# Altium schematic sheet PCA9306DP1.SchDoc
size A4
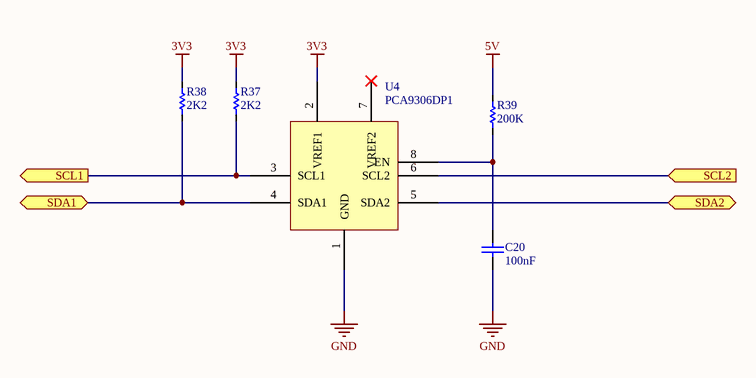
[diagram p0: PCA9306DP1.SchDoc]

## Parts
C20  100nF  [C0603(1608)]
R37  2K2  [R0603(1608)]
R38  2K2  [R0603(1608)]
R39  200K  [R0603(1608)]
U4  PCA9306DP1  [8-TSSOP]

## Ports
SCL1 (out), SCL2 (in), SDA1 (bidir), SDA2 (bidir)

## Nets
3V3: R37.2 R38.2 U4.2(VREF1)
5V: R39.2
GND: C20.1 U4.1(GND)
SCL1: R37.1 U4.3(SCL1) ; port SCL1
SCL2: U4.6(SCL2) ; port SCL2
SDA1: R38.1 U4.4(SDA1) ; port SDA1
SDA2: U4.5(SDA2) ; port SDA2
NetC20_2: C20.2 R39.1 U4.8(EN)

Not connected (* = marked no-connect by the designer): U4 7(VREF2)*

## Library data of the parts
C20 = Cap: Capacitor
R37-R39 = R: Resistor
U4 = PCA9306DP1: Dual bidirectional I2C-bus and SMBus voltage-level translator; Manufacturer: NXP Semiconductors; Manufacturer Part Number: PCA9306DP1,125; Translator Type: Voltage Level; Number of Circuits: 1; Channels per Circuit: 2; Voltage - VCCA: 1 V ~ 3.6 V; Voltage - VCCB: 1.8 V ~ 5.5 V; Output Type: Open Drain; Supplier 1: Digi-Key; RoHS: RoHS Compliant; Category: Integrated Circuits (ICs); Stock 1: 21322; Pricing 1: 1=0.74, 10=0.646, 100=0.494, 500=0.3914, 1000=0.3135 (USD); Packaging: Cut Tape (CT); Channel Type: Bidirectional; Input Signal: -; Output Signal: -; Data Rate: -; Operating Temperature: -40°C ~ 85°C (TA); Features: Auto-Direction Sensing; Mounting Type: Surface Mount; Package / Case: 8-TSSOP, 8-MSOP (0.118", 3.00mm Width); Supplier Device Package: 8-TSSOP; ComponentLink1URL: http://www.nxp.com/documents/data_sheet/PCA9306.pdf; ComponentLink1Description: http://www.nxp.com/documents/data_sheet/PCA9306.pdf; Supplier Part Number 1: 568-4243-1-ND